# Altium project ADCAN.PrjPcb (part 2 of 3)

## Sheet [1] Supply.SchDoc
size A4; SheetNumber: 2; SheetTotal: 6
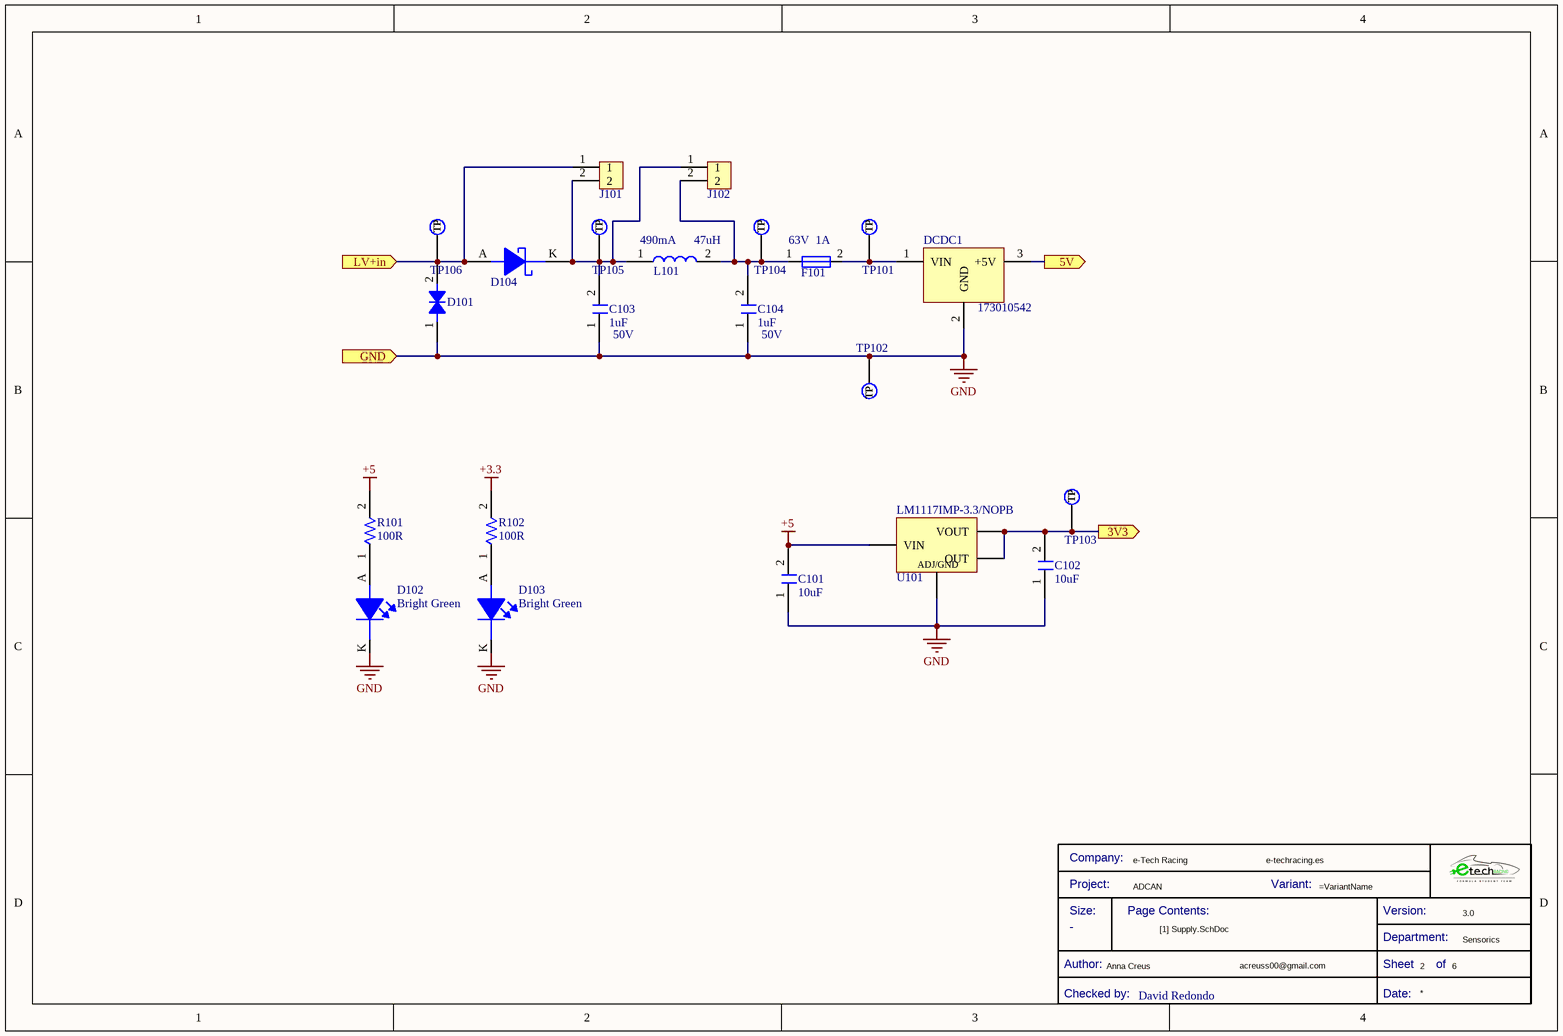
[diagram p2: [1] Supply.SchDoc]

### Parts
(Parts that share a designator on the sheet are numbered #1, #2 ... from top to bottom, then left to right.)
*#3  Checked by:: David Redondo  (hidden comment: Title Block_template)  (graphical)
C101  Capacitance: 10uF  [C1206FNPC-RW]  (hidden comment: 885012208018)
C102  Capacitance: 10uF  [C1206FNPC-RW]  (hidden comment: 885012208018)
C103  Capacitance: 1uF  [C0805FNPC-R]  (hidden comment: 885012207103)
C104  Capacitance: 1uF  [C0805FNPC-R]  (hidden comment: 885012207103)
D101  824551301  [DTVS-DO-214AB]  (value not drawn)
D102  Color: Bright Green  [LED_1206_WE]  (hidden comment: 150120VS75000)
D103  Color: Bright Green  [LED_1206_WE]  (hidden comment: 150120VS75000)
D104  MBR0530  [DSC-SOD123]  (value not drawn)
DCDC1  173010542  [DCDC_Slaves]
F101  Current Rating: 1A  Voltage Rating (AC): 63V  [Fuse_1206]  (hidden comment: 0437001.WRA)
J101  61300211121  [J_Pinheader_1x2]  (value not drawn)
J102  61300211121  [J_Pinheader_1x2]  (value not drawn)
L101  CDC5D23BNP-470KC  [L_47u-490mA_CF]  (value not drawn)
R101  Resistance: 100R  [R1206FTK-W]  (hidden comment: CRG1206F100R)
R102  Resistance: 100R  [R1206FTK-W]  (hidden comment: CRG1206F100R)
TP101  TestPoint  [TestPoint]  (value not drawn)  (no BOM)
TP102  TestPoint  [TestPoint]  (value not drawn)  (no BOM)
TP103  TestPoint  [TestPoint]  (value not drawn)  (no BOM)
TP104  TestPoint  [TestPoint]  (value not drawn)  (no BOM)
TP105  TestPoint  [TestPoint]  (value not drawn)  (no BOM)
TP106  TestPoint  [TestPoint]  (value not drawn)  (no BOM)
U101  LM1117IMP-3.3/NOPB  [LDO_10V-0.8/3V3-SOT223]

### Ports
3V3 (out), 5V (out), GND (in), LV+in (in)

### Nets
+3.3: C102.2 R102.2 TP103.1(TP) U101.2(OUT) U101.4(VOUT) ; port 3V3
+5: C101.2 DCDC1.3(+5V) R101.2 U101.3(VIN) ; port 5V
GND: C101.1 C102.1 C103.1 C104.1 D101.1 D102.K D103.K DCDC1.2(GND) TP102.1(TP) U101.1(ADJ/GND) ; port GND
LV+in: D101.2 D104.A J101.1 TP106.1(TP) ; port LV+in
NetC103_2: C103.2 D104.K J101.2 J102.1 L101.1 TP105.1(TP)
NetC104_2: C104.2 F101.1 J102.2 L101.2 TP104.1(TP)
NetD102_A: D102.A R101.1
NetD103_A: D103.A R102.1
NetDCDC1_1: DCDC1.1(VIN) F101.2 TP101.1(TP)

### Notes on the sheet
- (near L101) 490mA
- (near C103) 50V
- (near C104) 50V
- (in symbol Title Block_template) Company:; Project:; Variant:; Size:; Page Contents:; Version:; Department:; Author:; Sheet; of; Checked by:; Date:

### Library data of the parts
*#3 = Title Block_template: Standard Title Block; .Creator: GP; Category: Title Block; .PCBcheck: GP; .SCHcheck: GP; Size: -
C101 C102 = C10u-10V-1206FNPC-X7R: Cap, 10ΜF, 10V, 10%, X7R, 1206; Manufacturer 1: Wurth Electronics; Supplier 1: Digi-Key; Manufacturer Part Number 1: 885012208018; RoHS: Yes; Category: Ceramic Capacitors; Stock 1: 7; Pricing 1: 1=0,66000, 10=0,59800, 100=0,53600, 500=0,47400 (USD); Mount: Surface Mount; Case/Package: 1206; Case Code (Metric): 3216; Case Code (Imperial): 1206; Min Operating Temperature: -55°C; Max Operating Temperature: 125°C; Packaging: Tape and Reel; Voltage Rating: 10V; Tolerance: 10%; Length: 0.126inch; Width: 0.063inch; Thickness: 0.075inch; RoHS Compliant: Yes; ComponentLink1URL: http://www.farnell.com/datasheets/2031895.pdf?src-supplier=Farnell; ComponentLink1Description: http://www.farnell.com/datasheets/2031895.pdf?src-supplier=Farnell; ComponentLink2URL: https://katalog.we-online.de/pbs/datasheet/885012208018.pdf?src-supplier=Digi-Key; ComponentLink2Description: https://katalog.we-online.de/pbs/datasheet/885012208018.pdf?src-supplier=Digi-Key; ComponentLink3URL: http://www.farnell.com/datasheets/2031895.pdf?src-supplier=Newark; ComponentLink3Description: http://www.farnell.com/datasheets/2031895.pdf?src-supplier=Newark; Supplier Part Number 1: 732-7565-1-ND; ComponentLink4Description: Wurth Elektronik; ComponentLink4URL: https://www.we-online.com/catalog/en/WCAP-CSGP-10VDC?sq=885012208018#885012208018
C103 C104 = C1u-50V-0805FNPC-X7R: Multilayer Ceramic Capacitor, Wcap-Csgp Series, 1 F, 10%, X7R, 50 V, 0805 [2012 Metric] Rohs Compliant: Yes; Manufacturer 1: Wurth Electronics; Voltage Rating: 50V; .Creator: GP; Supplier 1: RSComponents; Manufacturer Part Number 1: 885012207103; RoHS: Yes; Category: Ceramic Capacitors; Stock 1: 5100; Pricing 1: 50=0,27200, 250=0,25300, 500=0,22800, 1250=0,20100, 2500=0,17100 (GBP); Mount: Surface Mount; Case/Package: 0805; Case Code (Metric): 2012; Case Code (Imperial): 0805; Min Operating Temperature: -55°C; Max Operating Temperature: 85°C; Packaging: Cut Tape; Dielectric: X7R; Tolerance: 10%; Voltage Rating (DC): 50V; Length: 0.079inch; Width: 0.049inch; Thickness: 0.053inch; REACH SVHC: Unknown; RoHS Compliant: Yes; ComponentLink1URL: http://www.farnell.com/datasheets/1958501.pdf?src-supplier=Farnell; ComponentLink1Description: http://www.farnell.com/datasheets/1958501.pdf?src-supplier=Farnell; ComponentLink2URL: http://www.farnell.com/datasheets/1958501.pdf?src-supplier=Element14; ComponentLink2Description: http://www.farnell.com/datasheets/1958501.pdf?src-supplier=Element14; ComponentLink3URL: https://katalog.we-online.de/pbs/datasheet/885012107003.pdf?src-supplier=Digi-Key; ComponentLink3Description: https://katalog.we-online.de/pbs/datasheet/885012107003.pdf?src-supplier=Digi-Key; ComponentLink4URL: http://www.farnell.com/datasheets/1958501.pdf?src-supplier=Newark; ComponentLink4Description: http://www.farnell.com/datasheets/1958501.pdf?src-supplier=Newark; Supplier Part Number 1: 1813523
D101 = DTVS-40V-DO-214AB: TVS diode [Würth Elektronik] 824551301 TVS diode; Manufacturer: Wurth Electronics; Number of Bidirectional Channels: 1; Reverse Standoff Voltage: 30V; Min Breakdown Voltage: 35.05V; Clamping Voltage: 48.4V; Peak Pulse Power: 3kW; Power Line Protection: No; Polarity: Bidirectional; Peak Pulse Current: 62A; .Creator: DO; ComponentLink2Description: Where buy it; ComponentLink2URL: https://www.we-online.com/catalog/en/WE-TVSP?sq=824551301#824551301; Supplier 1: RSComponents; Manufacturer Part Number: 824551301; RoHS: Yes; Category: TVS Diodes; Stock 1: 1; Pricing 1: 10=1,72500, 50=1,54700, 100=1,45300, 250=1,35100, 500=1,15000 (USD); Mount: Surface Mount; Number of Pins: 2; Min Operating Temperature: -65°C; Max Operating Temperature: 150°C; Packaging: Cut Tape; Max Breakdown Voltage: 35.05V; Resistor Type: Zener; REACH SVHC: Unknown; RoHS Compliant: Yes; ComponentLink1URL: http://www.farnell.com/datasheets/2036459.pdf?src-supplier=Element14; ComponentLink1Description: http://www.farnell.com/datasheets/2036459.pdf?src-supplier=Element14; Supplier Part Number 1: 9217092P
D102 D103 = LEDBGS-1206-40: Led, Green, 570 Nm, 2 V, 30 Ma, 40 Mcd Rohs Compliant: Yes; Manufacturer: Wurth Electronics; Luminous Intensity: 40mcd; Forward Current: 30mA; Viewing Angle: 140°; Lens Style: Clear,Rectangular; Wavelength: 570nm; Test Current: 20mA; Forward Voltage: 2V; Supplier 1: RSComponents; Manufacturer Part Number: 150120VS75000; RoHS: Yes; Category: LEDs; Stock 1: 1; Pricing 1: 50=0,23500, 500=0,16600, 750=0,15700, 1500=0,15100, 3000=0,14500 (USD); Mount: Surface Mount; Case/Package: 1206; Case Code (Metric): 3216; Case Code (Imperial): 1206; Min Operating Temperature: -40°C; Max Operating Temperature: 85°C; Package Quantity: 1; Packaging: Tape and Reel; Dominant Wavelength: 570nm; Length: 3.2mm; Width: 1.6mm; Height: 0.68mm; REACH SVHC: Unknown; RoHS Compliant: Yes; ComponentLink1URL: https://datasheet.ciiva.com/29561/150120vs75000-29561865.pdf?src-supplier=Digi-Key; ComponentLink1Description: https://datasheet.ciiva.com/29561/150120vs75000-29561865.pdf?src-supplier=Digi-Key; ComponentLink2URL: https://datasheet.ciiva.com/29279/759444-da-01-en-chipled-1206-w-kl-h-gruen-150120vs7500-29279050.pdf?src-supplier=Conrad; ComponentLink2Description: https://datasheet.ciiva.com/29279/759444-da-01-en-chipled-1206-w-kl-h-gruen-150120vs7500-29279050.pdf?src-supplier=Conrad; ComponentLink3URL: https://datasheet.ciiva.com/29561/150120vs75000-29561866.pdf?src-supplier=Digi-Key; ComponentLink3Description: https://datasheet.ciiva.com/29561/150120vs75000-29561866.pdf?src-supplier=Digi-Key; ComponentLink4URL: https://datasheet.ciiva.com/22656/1911467-22656987.pdf?src-supplier=Element14; ComponentLink4Description: https://datasheet.ciiva.com/22656/1911467-22656987.pdf?src-supplier=Element14; ComponentLink5URL: https://datasheet.ciiva.com/29561/150120vs75000-29561867.pdf?src-supplier=Digi-Key; ComponentLink5Description: https://datasheet.ciiva.com/29561/150120vs75000-29561867.pdf?src-supplier=Digi-Key; Supplier Part Number 1: 8154253P; ComponentLink6Description: Where buy it; ComponentLink6URL: https://www.we-online.com/catalog/en/WL-SMCW#/articles/WL-SMCW-1206
D104 = DSC-0.5/30-SOD123: VR=30V IF=500mA 30pF P=410mW; Element Configuration: Single; Forward Voltage: 430mV; Peak Non-Repetitive Surge Current: 5.5A; Average Rectified Current: 500mA; Max Reverse Leakage Current: 130uA; Max Reverse Voltage (DC): 30V; Polarity: Standard; .Creator: GP; Category: Diode; ComponentLink1Description: Datasheet; ComponentLink1URL: *; ComponentLink2Description: Where buy it; ComponentLink2URL: *; Supplier 1: Newark; Stock 1: 9; Pricing 1: 1=0,34400, 10=0,23900, 100=0,12200, 500=0,10000 (USD); Mount: Surface Mount; Contact Plating: Tin,Matte; Weight: 0.03g; Package Quantity: 1; Max Surge Current: 5.5A; Forward Current: 500mA; Max Reverse Current: 130uA; Max Repetitive Reverse Voltage (Vrrm): 30V; Max Forward Surge Current (Ifsm): 5.5A; Voltage Rating (DC): 30V; Current Rating: 500mA; Output Current: 500mA; Series: -; Length: 2.7mm; Width: 1.6mm; Height: 1.03mm; Radiation Hardening: No; RoHS Compliant: Yes; REACH SVHC: No SVHC; Lead Free: Lead Free; ComponentLink3URL: https://datasheet.ciiva.com/30479/0900766b810e2512-30479401.pdf?src-supplier=RSComponents; ComponentLink3Description: https://datasheet.ciiva.com/30479/0900766b810e2512-30479401.pdf?src-supplier=RSComponents; ComponentLink4URL: https://datasheet.ciiva.com/34301/974753-34301826.pdf?src-supplier=Jameco; ComponentLink4Description: https://datasheet.ciiva.com/34301/974753-34301826.pdf?src-supplier=Jameco; ComponentLink5URL: https://datasheet.ciiva.com/910/mbr0530-910516.pdf?src-supplier=Digi-Key; ComponentLink5Description: https://datasheet.ciiva.com/910/mbr0530-910516.pdf?src-supplier=Digi-Key; ComponentLink6URL: https://datasheet.ciiva.com/25931/mbr0530-25931989.pdf?src-supplier=Avnet+Europe; ComponentLink6Description: https://datasheet.ciiva.com/25931/mbr0530-25931989.pdf?src-supplier=Avnet+Europe; ComponentLink7URL: https://datasheet.ciiva.com/8300/mbr0530-8300905.pdf?src-supplier=Avnet; ComponentLink7Description: https://datasheet.ciiva.com/8300/mbr0530-8300905.pdf?src-supplier=Avnet; ComponentLink8URL: https://datasheet.ciiva.com/17318/mbr0530-17318568.pdf?src-supplier=Future+Electronics; ComponentLink8Description: https://datasheet.ciiva.com/17318/mbr0530-17318568.pdf?src-supplier=Future+Electronics; ComponentLink9URL: https://datasheet.ciiva.com/15144/getdatasheetpartid-86760-15144598.pdf?src-supplier=Verical; ComponentLink9Description: https://datasheet.ciiva.com/15144/getdatasheetpartid-86760-15144598.pdf?src-supplier=Verical; ComponentLink10URL: https://datasheet.ciiva.com/910/mbr0530-910518.pdf?src-supplier=Digi-Key; ComponentLink10Description: https://datasheet.ciiva.com/910/mbr0530-910518.pdf?src-supplier=Digi-Key; Supplier Part Number 1: 15R3453
DCDC1 = DCDC-42V/5V-1A: Würth Elektronik 8-42V to 5V 1A DC-DC; Manufacturer 1: Wurth Electronics; Number of Outputs: 1; Min Input Voltage: 8V; Max Input Voltage: 42V; Efficiency: 93%; .Creator: DR; Supplier 1: RSComponents; Manufacturer Part Number 1: 173010542; RoHS: Yes; Stock 1: 1; Pricing 1: 1=12,22500, 8=10,96900, 21=10,68900 (USD); Mount: Through Hole; Min Operating Temperature: -40°C; Max Operating Temperature: 85°C; Features: UVLO,OCP,OTP,SCP; Packaging: Rail/Tube; Voltage - Output 1: 5V; Max Output Current: 1A; RoHS Compliant: Yes; ComponentLink1URL: http://www.farnell.com/datasheets/2192895.pdf?src-supplier=Farnell; ComponentLink1Description: http://www.farnell.com/datasheets/2192895.pdf?src-supplier=Farnell; ComponentLink2URL: http://www.farnell.com/datasheets/2192895.pdf?src-supplier=Newark; ComponentLink2Description: http://www.farnell.com/datasheets/2192895.pdf?src-supplier=Newark; ComponentLink3URL: https://katalog.we-online.de/pm/datasheet/173010542.pdf?src-supplier=Digi-Key; ComponentLink3Description: https://katalog.we-online.de/pm/datasheet/173010542.pdf?src-supplier=Digi-Key; Supplier Part Number 1: 1447809
F101 = Fuse_1A_63V_1206: Fuse Chip Fast Acting 1A 63V SMD Solder Pad 1206 Ceramic T/R Automotive; Manufacturer: Littelfuse; Fuse Type: Board Mount (Cartridge Style Excluded); Approvals: CSA,cURus; Supplier 1: Digi-Key; Manufacturer Part Number: 0437001.WRA; RoHS: Yes; Category: Fuses; Stock 1: 5820; Pricing 1: 1=1,52000, 5=1,47000, 10=1,37600, 50=1,13860, 100=0,94880, 250=0,92508, 500=0,78276, 1000=0,68788 (USD); Mount: Surface Mount; Case/Package: 1206; Case Code (Imperial): 1206; Case Code (Metric): 3216; Min Operating Temperature: -55°C; Max Operating Temperature: 150°C; Packaging: Tape and Reel; Voltage Rating (DC): 63V; ComponentLink1URL: https://www.littelfuse.com/~/media/electronics/datasheets/fuses/littelfuse_fuse_437a_datasheet.pdf.pdf?src-supplier=Digi-Key; ComponentLink1Description: https://www.littelfuse.com/~/media/electronics/datasheets/fuses/littelfuse_fuse_437a_datasheet.pdf.pdf?src-supplier=Digi-Key; Supplier Part Number 1: F10001CT-ND; ComponentLink2Description: Where buy it; ComponentLink2URL: https://www.mouser.es/ProductDetail/Littelfuse/0437001WRA?qs=DXv0QSHKF4z9CJhPXjxR%252BA%3D%3D
J101 J102 = J_Jumper: CONN HEADER 2 POS 2.54; Manufacturer: Molex; Temperature rating: -40° to +105°C; Category type: PCB-PCB; Product name: Pin Header; Maximum current: 3 A; Maximum voltage: 250 V AC; Connections: 1x2; Current Rating: 3A; Voltage Rating: 250V; Number of Positions: 2; Gender: Male; Connector Type: Male Pin; Pitch: 0.1inch; .Creator: GP; Category: Connector; ComponentLink1Description: Datasheet; ComponentLink1URL: https://www.we-online.com/catalog/datasheet/61300211121.pdf; ComponentLink2Description: Where buy it; ComponentLink2URL: https://www.we-online.com/catalog/en/PHD_2_54_THT_PIN_HEADER_6130XX11121?sq=61300211121&sp=https%3A%2F%2Fwww.we-online.com%2Fweb%2Fen%2Fwuerth_elektronik%2Fsearchpage.php%3Fsearch%3D61300211121#61300211121; Manufacturer part number: 61300211121; Supplier: Würth Elektronik; RoHS: *; Application: Shortcircuit; Flammability: 94V-0; Orientation: Vertical; Mount: Through hole; Supplier 1: RSComponents; Stock 1: 1855; Pricing 1: 5=0,14100, 50=0,09700, 100=0,07800, 200=0,07300, 500=0,06800 (USD); Contact Plating: Gold; Housing Material: PBT; Contact Material: Copper Alloy,Copper; Color: Black; Min Operating Temperature: -40°C; Max Operating Temperature: 125°C; Number of Rows: 1; Contact Gender: Male; Packaging: Bulk; Termination: Through Hole; Number of Contacts: 2; Contact Mating Length: 0.236inch; REACH SVHC: Unknown; Lead Free: Lead Free; ComponentLink3URL: https://datasheet.ciiva.com/13619/6130xx11121-48870-13619345.pdf?src-supplier=Mouser; ComponentLink3Description: https://datasheet.ciiva.com/13619/6130xx11121-48870-13619345.pdf?src-supplier=Mouser; Supplier Part Number 1: 8281581
L101 = L_47u-490mA_CF: Inductor Power Unshielded Wirewound 47uH 10% 100KHz Ferrite 490mA 546mOhm DCR T/R; Manufacturer: Sumida; DC Resistance (DCR): 546mR; .Creator: GP; Supplier 1: Mouser; Manufacturer Part Number: CDC5D23BNP-470KC; RoHS: Yes; Category: Fixed Inductors; Stock 1: 3779; Pricing 1: 1=0,95000, 10=0,71100, 50=0,71100, 100=0,59700, 1000=0,40600, 10000=0,38100 (USD); Mount: Surface Mount; Case/Package: Nonstandard; Core Material: Ferrite; Weight: 0.007584oz; Min Operating Temperature: -40°C; Max Operating Temperature: 100°C; Tolerance: 10%; Shielding: Unshielded; Packaging: Tape and Reel; Package Quantity: 2000; Current Rating: 490mA; Inductance: 47uH; Max DC Current: 490mA; Termination: SMD/SMT; Test Frequency: 100kHz; Series: CDC5D23B; Length: 0.228inch; Width: 5.8mm; Height: 2.5mm; Height - Seated (Max): 0.098inch; Lead Free: Lead Free; RoHS Compliant: Yes; ComponentLink1URL: http://www.mouser.com/ds/2/390/CDC5D23B-465898.pdf?src-supplier=Mouser; ComponentLink1Description: http://www.mouser.com/ds/2/390/CDC5D23B-465898.pdf?src-supplier=Mouser; ComponentLink3URL: http://products.sumida.com/products/pdf/CDC5D23B.pdf?src-supplier=Digi-Key; ComponentLink3Description: http://products.sumida.com/products/pdf/CDC5D23B.pdf?src-supplier=Digi-Key; Supplier Part Number 1: 851-CDC5D23BNP-470KC
R101 R102 = R100-1206FTK: Res Thick Film 1206 100 Ohm 1% 0.25W(1/4W) ±200ppm/C Pad SMD T/R; Manufacturer: TE Connectivity; Temperature Coefficient: 200ppm/°C; Max Power Dissipation: 250mW; Voltage Rating: 200V; Number of Resistors: 1; Category: Resistor; ComponentLink1Description: Datasheet; ComponentLink1URL: https://docs.rs-online.com/7aab/0900766b815b7339.pdf; ComponentLink2Description: Where buy it; ComponentLink2URL: https://es.rs-online.com/web/p/resistencias-de-montaje-en-superficie/2232120; Supplier 1: Digi-Key; Manufacturer Part Number: CRG1206F100R; RoHS: Yes; Stock 1: 13476; Pricing 1: 1=0,10000, 10=0,07600, 100=0,02920, 1000=0,01285, 2500=0,01110 (USD); Mount: Surface Mount; Case/Package: 1206; Case Code (Imperial): 1206; Case Code (Metric): 3216; Weight: 0.000571oz; Min Operating Temperature: -55°C; Max Operating Temperature: 125°C; Tolerance: 1%; Resistor Type: Thick Film; Packaging: Tape and Reel; Package Quantity: 5000; Number of Terminations: 2; Series: CRG, Neohm; Power Rating: 250mW; Termination: Solder; Technology: THICK FILM; Length: 3.1mm; Width: 1.55mm; Height: 0.55mm; Depth: 1.55mm; Radiation Hardening: No; RoHS Compliant: Yes; ELV: Compliant; ComponentLink3URL: https://datasheet.ciiva.com/11808/0900766b800a696e-11808648.pdf?src-supplier=RSComponents; ComponentLink3Description: https://datasheet.ciiva.com/11808/0900766b800a696e-11808648.pdf?src-supplier=RSComponents; ComponentLink4URL: https://datasheet.ciiva.com/16763/70063020-16763547.pdf?src-supplier=Allied+Electronics; ComponentLink4Description: https://datasheet.ciiva.com/16763/70063020-16763547.pdf?src-supplier=Allied+Electronics; ComponentLink5URL: https://datasheet.ciiva.com/5562/eng-ds-1773204-g-5562604.pdf?src-supplier=Mouser; ComponentLink5Description: https://datasheet.ciiva.com/5562/eng-ds-1773204-g-5562604.pdf?src-supplier=Mouser; Supplier Part Number 1: A106068CT-ND
TP101-TP106 = TestPoint: Test Point 1x1 mm; Category: TestPoint
U101 = LDO_10V-0.8/3V3-SOT223: LDO Regulator Pos 3.3V 0.8A 4-Pin(3+Tab) SOT-223 T/R / IC REG LDO 3.3V 0.8A SOT223; Manufacturer: Texas Instruments; Number of Outputs: 1; Max Input Voltage: 15V; Max Output Current: 800mA; Polarity: Positive; Quiescent Current: 15mA; Accuracy: 1%; Output Type: Fixed; Dropout Voltage: 1.2V; Min Input Voltage: 2.6V; Max Supply Voltage: 10V; Min Supply Voltage: 4.75V; Current Rating: 800A; ComponentLink1URL: https://www.ti.com/lit/ds/symlink/lm1117.pdf?HQS=dis-mous-null-mousermode-dsf-pf-null-wwe&DCM=yes&ref_url=https%3A%2F%2Fwww.mouser.de%2F&distId=26; ComponentLink1Description: Datasheet; ComponentLink2Description: Where buy it; ComponentLink2URL: https://www.mouser.es/ProductDetail/Texas-Instruments/LM1117IMP-33-NOPB?qs=X1J7HmVL2ZFbpN1TgOsjYQ%3D%3D; Supplier 1: Digi-Key; Manufacturer Part Number: LM1117IMP-3.3/NOPB; RoHS: Yes; Category: LDO; Pricing 1: 1=1,41000, 10=1,26300, 25=1,19920, 100=0,98500, 250=0,92072, 500=0,81366 (USD); Mount: Surface Mount; Case/Package: SOT-223; Number of Pins: 4; Min Operating Temperature: -40°C; Max Operating Temperature: 125°C; Output Voltage: 3.3V; Packaging: Tape and Reel; Output Current: 800mA; Nominal Output Voltage: 3.3V; Termination: SMD/SMT; Output Voltage Accuracy: 1%; Number of Regulators: 1; Min Current Limit: 800mA; Package Quantity: 1000; Length: 6.5mm; Width: 3.56mm; Height: 1.6mm; Radiation Hardening: No; REACH SVHC: No SVHC; Lead Free: Lead Free; RoHS Compliant: Yes; ComponentLink3URL: https://datasheet.ciiva.com/27051/1281318-27051810.pdf?src-supplier=Jameco; ComponentLink3Description: https://datasheet.ciiva.com/27051/1281318-27051810.pdf?src-supplier=Jameco; ComponentLink4URL: https://datasheet.ciiva.com/8042/1670636-8042261.pdf?src-supplier=Element14; ComponentLink4Description: https://datasheet.ciiva.com/8042/1670636-8042261.pdf?src-supplier=Element14; ComponentLink5URL: https://datasheet.ciiva.com/1570/1849796-1570171.pdf?src-supplier=Farnell; ComponentLink5Description: https://datasheet.ciiva.com/1570/1849796-1570171.pdf?src-supplier=Farnell; ComponentLink6URL: https://datasheet.ciiva.com/14149/lm1117-eng-tds-14149980.pdf?src-supplier=Distrelec; ComponentLink6Description: https://datasheet.ciiva.com/14149/lm1117-eng-tds-14149980.pdf?src-supplier=Distrelec; ComponentLink7URL: https://datasheet.ciiva.com/46386/1882372-46386042.pdf?src-supplier=Element14; ComponentLink7Description: https://datasheet.ciiva.com/46386/1882372-46386042.pdf?src-supplier=Element14; ComponentLink8URL: https://datasheet.ciiva.com/3223/lm1117-n-3223515.pdf?src-supplier=Avnet; ComponentLink8Description: https://datasheet.ciiva.com/3223/lm1117-n-3223515.pdf?src-supplier=Avnet; ComponentLink9URL: https://datasheet.ciiva.com/6580/lm1117-n-6580030.pdf?src-supplier=Digi-Key; ComponentLink9Description: https://datasheet.ciiva.com/6580/lm1117-n-6580030.pdf?src-supplier=Digi-Key; ComponentLink10URL: https://datasheet.ciiva.com/6580/lm1117-n-6580026.pdf?src-supplier=Digi-Key; ComponentLink10Description: https://datasheet.ciiva.com/6580/lm1117-n-6580026.pdf?src-supplier=Digi-Key; Supplier Part Number 1: LM1117IMP-3.3/NOPBCT-ND

## Sheet [3] CAN.SchDoc
size A4; SheetNumber: 4; SheetTotal: 6
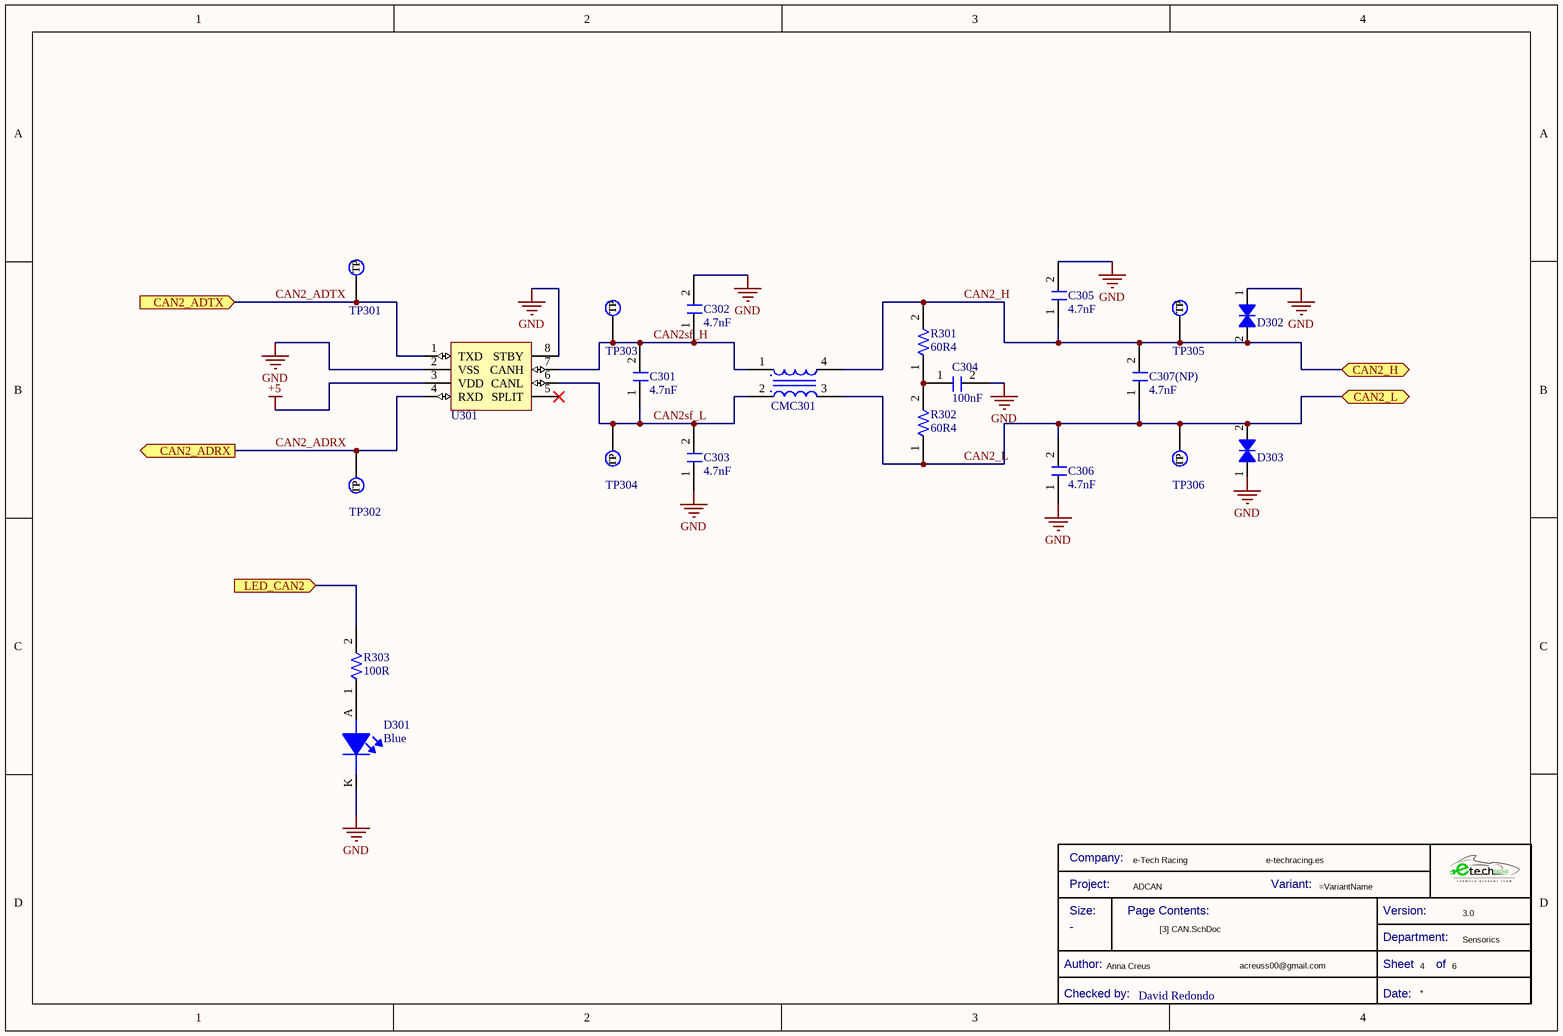
[diagram p3: [3] CAN.SchDoc]

### Parts
(Parts that share a designator on the sheet are numbered #1, #2 ... from top to bottom, then left to right.)
*#4  Checked by:: David Redondo  (hidden comment: Title Block_template)  (graphical)
C301  Capacitance: 4.7nF  [C1206FNPC-RW]  (hidden comment: 885012208025)
C302  Capacitance: 4.7nF  [C1206FNPC-RW]  (hidden comment: 885012208025)
C303  Capacitance: 4.7nF  [C1206FNPC-RW]  (hidden comment: 885012208025)
C304  Capacitance: 100nF  [C1206FNPC-RW]  (hidden comment: 885012208009)
C305  Capacitance: 4.7nF  [C1206FNPC-RW]  (hidden comment: 885012208025)
C306  Capacitance: 4.7nF  [C1206FNPC-RW]  (hidden comment: 885012208025)
C307(NP)  Capacitance: 4.7nF  [C1206FNPC-RW]  (hidden comment: 885012208025)
CMC301  744226  [CMC_10u_1.6A]  (value not drawn)
D301  Color: Blue  [LED_1206_WE]  (hidden comment: 150120BS75000)
D302  824501600  [DTVS-DO-214AC]  (value not drawn)
D303  824501600  [DTVS-DO-214AC]  (value not drawn)
R301  value 60R4  [R1206FTK-W]  (hidden comment: RQ73C2B60R4BTDF)
R302  value 60R4  [R1206FTK-W]  (hidden comment: RQ73C2B60R4BTDF)
R303  Resistance: 100R  [R1206FTK-W]  (hidden comment: CRG1206F100R)
TP301  TestPoint  [TestPoint]  (value not drawn)  (no BOM)
TP302  TestPoint  [TestPoint]  (value not drawn)  (no BOM)
TP303  TestPoint  [TestPoint]  (value not drawn)  (no BOM)
TP304  TestPoint  [TestPoint]  (value not drawn)  (no BOM)
TP305  TestPoint  [TestPoint]  (value not drawn)  (no BOM)
TP306  TestPoint  [TestPoint]  (value not drawn)  (no BOM)
U301  MCP2561-H/SN  [Transceiver_CAN]  (value not drawn)

### Ports
CAN2_ADRX (out), CAN2_ADTX (in), CAN2_H (bidir), CAN2_L (bidir), LED_CAN2 (in)

### Nets
+5: U301.3(VDD)
GND: C302.2 C303.1 C304.2 C305.2 C306.1 D301.K D302.1 D303.1 U301.2(VSS) U301.8(STBY)
CAN2_ADRX: TP302.1(TP) U301.4(RXD) ; port CAN2_ADRX
CAN2_ADTX: TP301.1(TP) U301.1(TXD) ; port CAN2_ADTX
CAN2_H: C305.1 C307(NP).2 CMC301.4(4_OUT) D302.2 R301.2 TP305.1(TP) ; port CAN2_H
CAN2_L: C306.2 C307(NP).1 CMC301.3(3_OUT) D303.2 R302.1 TP306.1(TP) ; port CAN2_L
CAN2sf_H: C301.2 C302.1 CMC301.1(1_IN) TP303.1(TP) U301.7(CANH)
CAN2sf_L: C301.1 C303.2 CMC301.2(2_IN) TP304.1(TP) U301.6(CANL)
LED_CAN2: R303.2 ; port LED_CAN2
NetC304_1: C304.1 R301.1 R302.2
NetD301_A: D301.A R303.1

Not connected (* = marked no-connect by the designer): U301 5(SPLIT)*

### Notes on the sheet
- (in symbol Title Block_template) Company:; Project:; Variant:; Size:; Page Contents:; Version:; Department:; Author:; Sheet; of; Checked by:; Date:

### Library data of the parts
*#4 = Title Block_template: Standard Title Block; .Creator: GP; Category: Title Block; .PCBcheck: GP; .SCHcheck: GP; Size: -
C301-C303 C305 C306 C307(NP) = C4.7n-16V-1206FNPC-X7R: Cap, 4700PF, 16V, 10%, X7R, 1206; Manufacturer: Wurth Electronics; Material: Ceramic; Category: Capacitor; ComponentLink1Description: Datasheet; ComponentLink1URL: https://www.we-online.com/catalog/datasheet/885012208025.pdf; ComponentLink2Description: Where buy it; ComponentLink2URL: https://www.we-online.com/catalog/en/WCAP-CSGP-16VDC#885012208025; Supplier 1: Digi-Key; Manufacturer Part Number: 885012208025; RoHS: Yes; Stock 1: 2013; Pricing 1: 1=0,14000, 10=0,12500, 100=0,11200, 500=0,09900 (USD); Mount: Surface Mount; Case/Package: 1206; Case Code (Metric): 3216; Case Code (Imperial): 1206; Min Operating Temperature: -55°C; Max Operating Temperature: 125°C; Tolerance: 10%; Packaging: Cut Tape; Voltage Rating: 16V; Length: 0.126inch; Width: 0.063inch; Height: 1.6mm; Thickness: 0.035inch; RoHS Compliant: Yes; Supplier Part Number 1: 732-8092-1-ND
C304 = C100n-10V-1206FNPC-X7R: Cap, 0.1ΜF, 10V, 10%, X7R, 1206; Manufacturer 1: Wurth Electronics; Supplier 1: Digi-Key; Manufacturer Part Number 1: 885012208009; RoHS: Yes; Category: Ceramic Capacitors; Stock 1: 7198; Pricing 1: 1=0,11000, 10=0,10300, 100=0,09200, 500=0,08100 (USD); Mount: Surface Mount; Case/Package: 1206; Case Code (Metric): 3216; Case Code (Imperial): 1206; Min Operating Temperature: -55°C; Max Operating Temperature: 125°C; Packaging: Tape and Reel; Voltage Rating: 10V; Tolerance: 10%; Length: 0.126inch; Width: 0.063inch; Thickness: 0.035inch; RoHS Compliant: Yes; ComponentLink1URL: http://www.farnell.com/datasheets/2031891.pdf?src-supplier=Farnell; ComponentLink1Description: http://www.farnell.com/datasheets/2031891.pdf?src-supplier=Farnell; ComponentLink2URL: http://katalog.we-online.de/pbs/datasheet/885012208009.pdf?src-supplier=Digi-Key; ComponentLink2Description: http://katalog.we-online.de/pbs/datasheet/885012208009.pdf?src-supplier=Digi-Key; ComponentLink3URL: https://katalog.we-online.de/pbs/datasheet/885012208009.pdf?src-supplier=Digi-Key; ComponentLink3Description: https://katalog.we-online.de/pbs/datasheet/885012208009.pdf?src-supplier=Digi-Key; Supplier Part Number 1: 732-8086-1-ND; ComponentLink4Description: Wurth Elektronik; ComponentLink4URL: https://www.we-online.com/catalog/en/WCAP-CSGP-10VDC?sq=885012208009#885012208009
CMC301 = CMC_10u_1.6A: Common Mode Chokes Dual 10uH 920Ohm 1kHz 1.6A 80mOhm DCR SMD T/R; Manufacturer: Wurth Electronics; Core Material: Ferrite; Voltage Rating: 80V; Tolerance: 30%; Impedance: 920R; Resistance: 80mR; Number of Lines: 2; Category: Common Mode Line Filter; ComponentLink1Description: Datasheet; ComponentLink1URL: https://www.we-online.com/catalog/datasheet/744226.pdf; ComponentLink2Description: Where buy it; ComponentLink2URL: https://www.we-online.com/catalog/en/WE-SL2?sq=744226#744226; Supplier 1: Digi-Key; Manufacturer Part Number: 744226; RoHS: Yes; Stock 1: 1943; Pricing 1: 1=2,55000, 10=2,51500, 50=2,27200, 100=2,19100, 500=2,02900 (USD); Mount: Surface Mount; Case/Package: SMD/SMT; Number of Pins: 4; Weight: 0.017672oz; Min Operating Temperature: -40°C; Max Operating Temperature: 125°C; Packaging: Tape and Reel; Package Quantity: 1; Termination: SMD/SMT; Series: WE-SL2; Inductance: 10uH; Voltage Rating (DC): 80V; Current Rating: 1.6A; Max DC Current: 1.6A; DC Resistance (DCR): 80mR; Test Frequency: 1kHz; Current: 1.6A; Inductance Tolerance: 30%; DC Current: 1.6A; Length: 9.2mm; Width: 6mm; Height: 5mm; Depth: 6.3mm; RoHS Compliant: Yes; REACH SVHC: No SVHC; Lead Free: Lead Free; Supplier Part Number 1: 732-1475-1-ND
D301 = LEDBS-1206-145: Led, Blue, 470 Nm, 3.2 V, 30 Ma, 145 Mcd Rohs Compliant: Yes; Manufacturer: Wurth Electronics; Luminous Intensity: 145mcd; Viewing Angle: 140°; Wavelength: 470nm; Forward Current: 30mA; Lens Style: Clear,Rectangular; Test Current: 20mA; Forward Voltage: 3.2V; Supplier 1: RSComponents; Manufacturer Part Number: 150120BS75000; RoHS: Yes; Category: LEDs; Stock 1: 1; Pricing 1: 50=0,23200, 500=0,16400, 750=0,15500, 1500=0,15000, 3000=0,14200 (USD); Mount: Surface Mount; Case/Package: 1206; Case Code (Metric): 3216; Case Code (Imperial): 1206; Min Operating Temperature: -40°C; Max Operating Temperature: 85°C; Package Quantity: 3000; Packaging: Tape and Reel; Dominant Wavelength: 470nm; Length: 3.2mm; Width: 1.6mm; Height: 0.68mm; REACH SVHC: Unknown; RoHS Compliant: Yes; ComponentLink1URL: https://datasheet.ciiva.com/22656/150120bs75000-22656976.pdf?src-supplier=Element14; ComponentLink1Description: https://datasheet.ciiva.com/22656/150120bs75000-22656976.pdf?src-supplier=Element14; ComponentLink2URL: https://datasheet.ciiva.com/29279/759440-da-01-en-chipled-1206-w-kl-blau-150120bs75000-29279045.pdf?src-supplier=Conrad; ComponentLink2Description: https://datasheet.ciiva.com/29279/759440-da-01-en-chipled-1206-w-kl-blau-150120bs75000-29279045.pdf?src-supplier=Conrad; ComponentLink3URL: https://datasheet.ciiva.com/29561/150120bs75000-29561882.pdf?src-supplier=Digi-Key; ComponentLink3Description: https://datasheet.ciiva.com/29561/150120bs75000-29561882.pdf?src-supplier=Digi-Key; Supplier Part Number 1: 8154243; ComponentLink4Description: Where buy it; ComponentLink4URL: https://www.we-online.com/catalog/en/WL-SMCW?sq=150120BS75000#150120BS75000
D302 D303 = DTVS-6V-DO-214AC: TVS diode [Würth Elektronik] 824501600 TVS diode; Manufacturer: Wurth Electronics; Number of Bidirectional Channels: 1; Reverse Standoff Voltage: 6V; Min Breakdown Voltage: 7.02V; Clamping Voltage: 10.3V; Peak Pulse Power: 400W; Power Line Protection: No; Polarity: Bidirectional; Peak Pulse Current: 38.8A; ComponentLink1Description: Where buy it; ComponentLink1URL: https://www.we-online.com/catalog/en/WE-TVSP?sq=824501600#824501600; Supplier 1: Mouser; Manufacturer Part Number: 824501600; RoHS: Yes; Category: TVS Diodes; Stock 1: 780; Pricing 1: 1=0,28000, 10=0,26100, 50=0,26100, 100=0,23400, 500=0,20400, 1000=0,17400, 10000=0,17400 (USD); Mount: Surface Mount; Number of Pins: 2; Min Operating Temperature: -65°C; Max Operating Temperature: 150°C; Packaging: Cut Tape; Max Breakdown Voltage: 7.02V; Resistor Type: Zener; REACH SVHC: Unknown; RoHS Compliant: Yes; ComponentLink2URL: http://www.farnell.com/datasheets/2036401.pdf?src-supplier=Element14; ComponentLink2Description: http://www.farnell.com/datasheets/2036401.pdf?src-supplier=Element14; Supplier Part Number 1: 710-824501600; ComponentLink3URL: https://katalog.we-online.de/pbs/datasheet/824501600.pdf?src-supplier=Digi-Key; ComponentLink3Description: https://katalog.we-online.de/pbs/datasheet/824501600.pdf?src-supplier=Digi-Key
R301 R302 = R60-1206FTN: Res Precision Thin Film 60.4Ohm 0.1% 400mW 10ppm/°C 2-Pin 1206 SMD T/R; Manufacturer: TE Connectivity Holsworthy; Category: Resistor; ComponentLink1Description: Datasheet; ComponentLink1URL: https://docs.rs-online.com/7017/0900766b8171e31c.pdf; ComponentLink2Description: Where buy it; ComponentLink2URL: https://es.rs-online.com/web/p/resistencias-de-montaje-en-superficie/1873086; Supplier 1: RSComponents; Manufacturer Part Number: RQ73C2B60R4BTDF; RoHS: Yes; Stock 1: 650; Pricing 1: 1000=1,73300 (GBP); Supplier Part Number 1: 1872611
R303 = R100-1206FTK: as R101 on sheet [1] Supply; Category: Resistor; ComponentLink1Description: Datasheet; ComponentLink1URL: https://docs.rs-online.com/7aab/0900766b815b7339.pdf; ComponentLink2Description: Where buy it; ComponentLink2URL: https://es.rs-online.com/web/p/resistencias-de-montaje-en-superficie/2232120; Supplier 1: Digi-Key; Manufacturer Part Number: CRG1206F100R; RoHS: Yes; Stock 1: 13476; Pricing 1: 1=0,10000, 10=0,07600, 100=0,02920, 1000=0,01285, 2500=0,01110 (USD); Mount: Surface Mount; Case/Package: 1206; Case Code (Imperial): 1206; Case Code (Metric): 3216; Weight: 0.000571oz; Min Operating Temperature: -55°C; Max Operating Temperature: 125°C; Tolerance: 1%; Resistor Type: Thick Film; Packaging: Tape and Reel; Package Quantity: 5000; Number of Terminations: 2; Series: CRG, Neohm; Power Rating: 250mW; Termination: Solder; Technology: THICK FILM; Length: 3.1mm; Width: 1.55mm; Height: 0.55mm; Depth: 1.55mm; Radiation Hardening: No; RoHS Compliant: Yes; ELV: Compliant; ComponentLink3URL: https://datasheet.ciiva.com/11808/0900766b800a696e-11808648.pdf?src-supplier=RSComponents; ComponentLink3Description: https://datasheet.ciiva.com/11808/0900766b800a696e-11808648.pdf?src-supplier=RSComponents; ComponentLink4URL: https://datasheet.ciiva.com/16763/70063020-16763547.pdf?src-supplier=Allied+Electronics; ComponentLink4Description: https://datasheet.ciiva.com/16763/70063020-16763547.pdf?src-supplier=Allied+Electronics; ComponentLink5URL: https://datasheet.ciiva.com/5562/eng-ds-1773204-g-5562604.pdf?src-supplier=Mouser; ComponentLink5Description: https://datasheet.ciiva.com/5562/eng-ds-1773204-g-5562604.pdf?src-supplier=Mouser; Supplier Part Number 1: A106068CT-ND
TP301-TP306 = TestPoint: Test Point 1x1 mm; Category: TestPoint
U301 = Transceiver_CAN: CAN Transceiver, 4.5 to 5.5V, 70mA, -40 to 150C, SOIC-8, RoHS; Manufacturer: Digi-Key; Manufacturer part: Microchip; Min Supply Voltage: 4.5V; Data Rate: 1Mbps; Operating Supply Voltage: 5V; Nominal Supply Current: 75mA; Number of Transceivers: 1; Slew Rate: 8.5V/µs; Propagation Delay: 125ns; RoHS: Yes; Mount: SMD; Case/Package: SOIC; Number of Pins: 8; Min Operating Temperature: -40°C; Max Operating Temperature: 85°C; Max Supply Voltage: 5.5V; Packaging: Rail/Tube; Interface: CAN; Number of Transmit Buffers: 1; Number of Receive Buffers: 1; Max Supply Current: 75mA; Number of Drivers: 1; Number of Receivers: 1; REACH SVHC: No SVHC; ComponentLink1URL: https://pdf1.alldatasheet.com/datasheet-pdf/view/514790/MICROCHIP/MCP2561.html; ComponentLink1Description: Datasheet; Category: Transceiver CAN; ComponentLink2Description: Where buy it; ComponentLink2URL: *; Supplier 1: Digi-Key; Manufacturer Part Number: MCP2561-H/SN; Pricing 1: 1=1,17000, 25=0,96480, 100=0,90000 (USD); Package Quantity: 100; Turn-On Delay Time: 125ns; Radiation Hardening: No; RoHS Compliant: Yes; ComponentLink3URL: https://datasheet.ciiva.com/18624/25167b-18624813.pdf?src-supplier=Digi-Key; ComponentLink3Description: https://datasheet.ciiva.com/18624/25167b-18624813.pdf?src-supplier=Digi-Key; Supplier Part Number 1: MCP2561-H/SN-ND